# Altium schematic sheet LED_bargraph.SchDoc
size A3
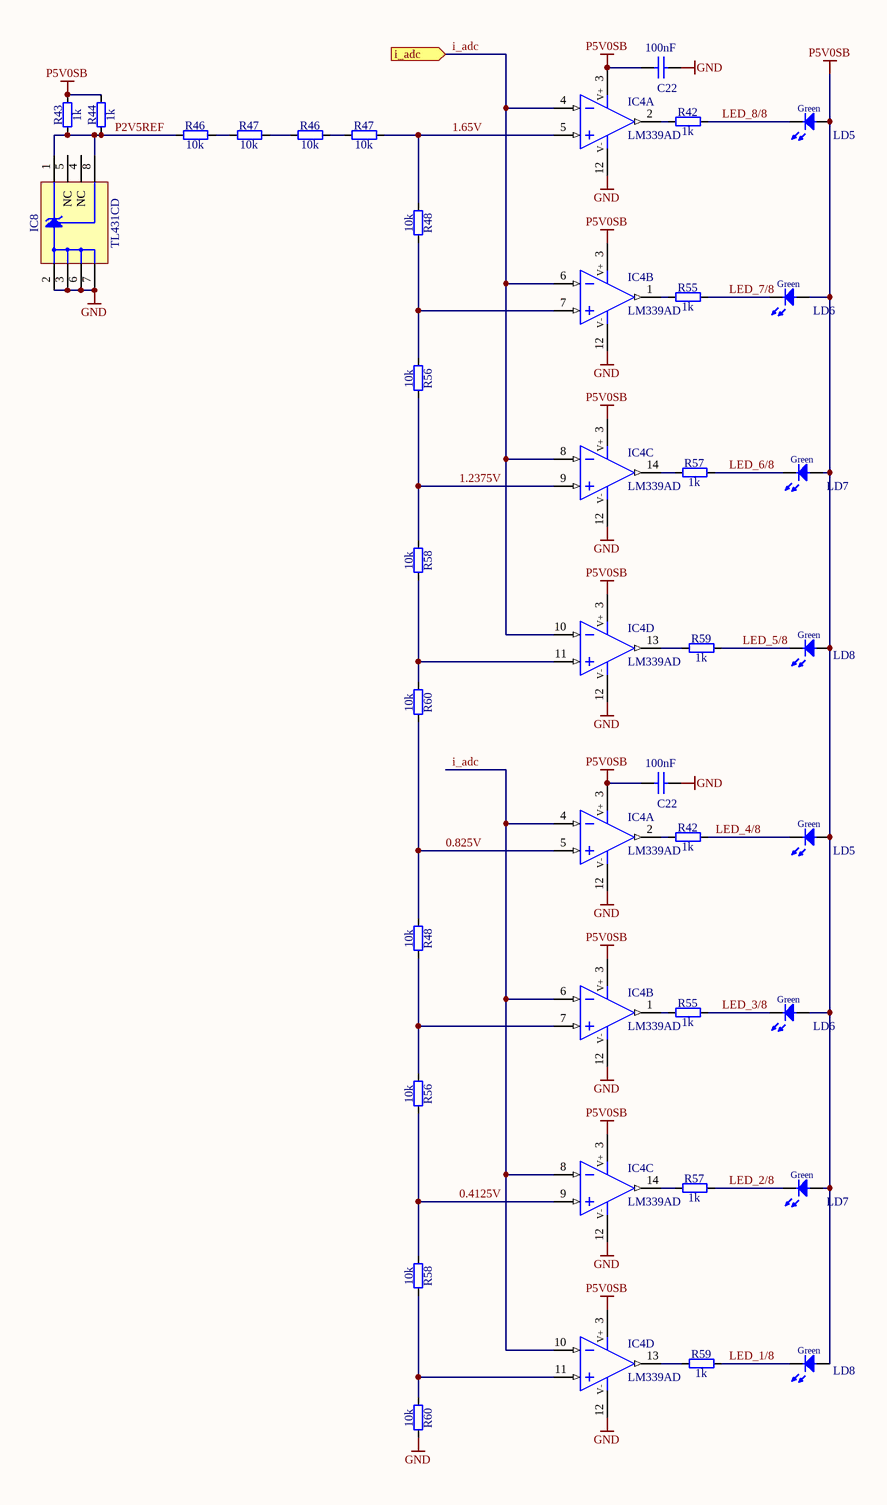
[diagram p0: LED_bargraph.SchDoc]

## Parts
(Parts that share a designator on the sheet are numbered #1, #2 ... from top to bottom, then left to right.)
C22#1  100nF  [CAPC1005X55N]
C22#2  100nF  [CAPC1005X55N]
IC4#1  LM339AD  [SOIC127P600X175-14N]  (parts A,B,C,D of 4)
IC4#2  LM339AD  [SOIC127P600X175-14N]  (parts A,B,C,D of 4)
IC8  TL431CD  [SOIC127P600X175-8N]
LD5#1  Green  [LED_AVAGO_HSME-C120]
LD5#2  Green  [LED_AVAGO_HSME-C120]
LD6#1  Green  [LED_AVAGO_HSME-C120]
LD6#2  Green  [LED_AVAGO_HSME-C120]
LD7#1  Green  [LED_AVAGO_HSME-C120]
LD7#2  Green  [LED_AVAGO_HSME-C120]
LD8#1  Green  [LED_AVAGO_HSME-C120]
LD8#2  Green  [LED_AVAGO_HSME-C120]
R42#1  1k  [RESC1608X55N]
R42#2  1k  [RESC1608X55N]
R43  1k  [RESC1608X55N]
R44  1k  [RESC1608X55N]
R46#1  10k  [RESC1608X55N]
R46#2  10k  [RESC1608X55N]
R47#1  10k  [RESC1608X55N]
R47#2  10k  [RESC1608X55N]
R48#1  10k  [RESC1608X55N]
R48#2  10k  [RESC1608X55N]
R55#1  1k  [RESC1608X55N]
R55#2  1k  [RESC1608X55N]
R56#1  10k  [RESC1608X55N]
R56#2  10k  [RESC1608X55N]
R57#1  1k  [RESC1608X55N]
R57#2  1k  [RESC1608X55N]
R58#1  10k  [RESC1608X55N]
R58#2  10k  [RESC1608X55N]
R59#1  1k  [RESC1608X55N]
R59#2  1k  [RESC1608X55N]
R60#1  10k  [RESC1608X55N]
R60#2  10k  [RESC1608X55N]

## Ports
i_adc (in)

## Nets
GND: C22#1.1 C22#2.1 IC4#1.12(V-) IC4#2.12(V-) IC8.2(A) IC8.3(A) IC8.6(A) IC8.7(A) R60#2.2
P5V0SB: C22#1.2 C22#2.2 IC4#1.3(V+) IC4#2.3(V+) LD5#1.2(A) LD5#2.2(A) LD6#1.2(A) LD6#2.2(A) LD7#1.2(A) LD7#2.2(A) LD8#1.2(A) LD8#2.2(A) R43.2 R44.2
0.825V: IC4#2.5(IN+) R48#2.1 R60#1.2
0.4125V: IC4#2.9(IN+) R56#2.2 R58#2.1
1.65V: IC4#1.5(IN+) R47#2.2 R48#1.1
1.2375V: IC4#1.9(IN+) R56#1.2 R58#1.1
i_adc: IC4#1.4(IN-) IC4#1.6(IN-) IC4#1.8(IN-) IC4#1.10(IN-) IC4#2.4(IN-) IC4#2.6(IN-) IC4#2.8(IN-) IC4#2.10(IN-) ; port i_adc
LED_1/8: LD8#2.1(C) R59#2.2
LED_2/8: LD7#2.1(C) R57#2.2
LED_3/8: LD6#2.1(C) R55#2.2
LED_4/8: LD5#2.1(C) R42#2.2
LED_5/8: LD8#1.1(C) R59#1.2
LED_6/8: LD7#1.1(C) R57#1.2
LED_7/8: LD6#1.1(C) R55#1.2
LED_8/8: LD5#1.1(C) R42#1.2
P2V5REF: IC8.1(C) IC8.8(REF) R43.1 R44.1 R46#1.1
NetIC4#1_1: IC4#1.1(OUT) R55#1.1
NetIC4#1_2: IC4#1.2(OUT) R42#1.1
NetIC4#1_7: IC4#1.7(IN+) R48#1.2 R56#1.1
NetIC4#1_11: IC4#1.11(IN+) R58#1.2 R60#1.1
NetIC4#1_13: IC4#1.13(OUT) R59#1.1
NetIC4#1_14: IC4#1.14(OUT) R57#1.1
NetIC4#2_1: IC4#2.1(OUT) R55#2.1
NetIC4#2_2: IC4#2.2(OUT) R42#2.1
NetIC4#2_7: IC4#2.7(IN+) R48#2.2 R56#2.1
NetIC4#2_11: IC4#2.11(IN+) R58#2.2 R60#2.1
NetIC4#2_13: IC4#2.13(OUT) R59#2.1
NetIC4#2_14: IC4#2.14(OUT) R57#2.1
NetR46#1_2: R46#1.2 R47#1.1
NetR46#2_1: R46#2.1 R47#1.2
NetR46#2_2: R46#2.2 R47#2.1

Not connected (* = marked no-connect by the designer): IC8 4(NC) 5(NC)

## Library data of the parts
C22#1 C22#2 = CC0402_100NF_25V_10%_X7R_YUDEN_TMK105B7104KVHF: Non-polarised capacitor; Part Description: SMD Multilayer Chip Ceramic Capacitor (High Dielectric Type) for Automotive / Industrial Applications; Manufacturer: TAIYO YUDEN; Voltage: 25V; TC: X7R; Tolerance: ±10%; Part Number: CC0402_100NF_25V_10%_X7R_YUDEN_TMK105B7104KVHF; Component Kind: Standard; Component Type: Standard; Pin Count: 2; Value: 100nF; Status: Not Recommended; Manufacturer Part Number: TMK105B7104KVHF; Case: 0402; Mounted: Yes; Socket: No; SMD: Yes; Sense: No; HelpURL: \\cern.ch\dfs\Applications\Altium\Datasheets\CC0402_TAIYO-YUDEN_TMK105B7104KVHF.pdf; Author: CERN DEM JLC; CreateDate: 10/05/2017; LatestRevisionDate: 10/05/2017; ComponentHeight: 0.55mm
IC4#1 IC4#2 = LM339AD: Quad Operational Amplifier; Part Description: Quad Differential Comparator; Manufacturer: TEXAS INSTRUMENTS; PressFit: No; Bonding: No; Part Number: LM339AD; Component Kind: Standard; Component Type: Standard; Device: LM339AD; PackageDescription: SOIC 14, Pitch 1.27mm - Body 4x8.75mm, IPC Medium Density; Manufacturer Part Number: LM339AD; Pin Count: 14; Case: SOIC14; Mounted: Yes; Socket: No; SMD: Yes; Sense: No; ComponentHeight: 1.75mm; Author: CERN DEM JLC; HelpURL: \\cern.ch\dfs\Applications\Altium\Datasheets\LM339AD.pdf; CreateDate: 09.03.2011; LatestRevisionDate: 09.03.2011
IC8 = TL431CD: Precision Programmable Reference; Part Description: Vref (2.5V) To 36V 2% Precision Programmable Reference; Manufacturer: TEXAS INSTRUMENTS; PressFit: No; Bonding: No; Part Number: TL431CD; Component Kind: Standard; Component Type: Standard; Device: TL431CD; PackageDescription: SOIC 8, Pitch 1.27mm, Body 4x5mm, IPC Medium Density; Manufacturer Part Number: TL431CD; Pin Count: 8; Case: SOIC8; Mounted: Yes; Socket: No; SMD: Yes; Sense: No; ComponentHeight: 1.75mm; HelpURL: \\cern.ch\dfs\Applications\Altium\Datasheets\TL431CD.pdf; Author: CERN DEM JLC; CreateDate: 18.01.2011; LatestRevisionDate: 28.02.2011
LD5#1 LD5#2 LD6#1 LD6#2 LD7#1 LD7#2 LD8#1 LD8#2 = LED_AVAGO_HSME-C120: LED Green 1C 2A; Part Description: High Performance Right Angle Chip Green LED; Manufacturer: AVAGO TECHNOLOGIES; PressFit: No; Bonding: No; Part Number: LED_AVAGO_HSME-C120; Component Kind: Standard; Component Type: Standard; Color: Green; PackageDescription: Green Chip LED, 2-Leads, Body 1.7x1.1mm, Side Emitting Package; Manufacturer Part Number: HSME-C120; Pin Count: 2; Mounted: Yes; Socket: No; SMD: Yes; Sense: No; ComponentHeight: 0.7mm; HelpURL: \\cern.ch\dfs\Applications\Altium\Datasheets\LED_AVAGO_HSME-C120.pdf; ComponentLink1URL: \\cern.ch\dfs\Applications\Altium\Datasheets\LED_AVAGO_HSME-C110_DESIGN-GUIDE.pdf; ComponentLink1Description: Design Guide; Author: CERN DEM JMW; CreateDate: 22.07.2009; LatestRevisionDate: 20.06.2012
R42#1 R42#2 R43 R44 R55#1 R55#2 R57#1 R57#2 R59#1 R59#2 = R0603_1K_1%_0.1W_100PPM: Resistor - 1%; Part Description: General Purpose Thick Film Chip Resistor; Manufacturer: GENERIC; Manufacturer1 Part Number: NRC06F1001TRF; Power: 0.1W; TC: ±100ppm/°C; PressFit: No; Part Number: R0603_1K_1%_0.1W_100PPM; Component Kind: Standard; Component Type: Standard; Pin Count: 2; Value: 1k; Status: Preferred; Tolerance: ±1%; Manufacturer Part Number: R0603_1K_1%_0.1W_100PPM; Case: 0603; Mounted: Yes; Sense: No; Socket: No; SMD: Yes; Manufacturer1 Example: NIC COMPONENT; Manufacturer1 ComponentHeight: 0.55mm; HelpURL: \\cern.ch\dfs\Applications\Altium\Datasheets\R0603_NIC_NRC.pdf; Author: CERN DEM JLC; CreateDate: 03.12.2007; LatestRevisionDate: 13.03.2008
R46#1 R46#2 R47#1 R47#2 R48#1 R48#2 R56#1 R56#2 R58#1 R58#2 R60#1 R60#2 = R0603_10K_1%_0.1W_100PPM: Resistor - 1%; Part Description: General Purpose Thick Film Chip Resistor; Manufacturer: GENERIC; Manufacturer1 Part Number: NRC06F1002TRF; Power: 0.1W; TC: ±100ppm/°C; PressFit: No; Part Number: R0603_10K_1%_0.1W_100PPM; Component Kind: Standard; Component Type: Standard; Pin Count: 2; Value: 10k; Status: Preferred; Tolerance: ±1%; Manufacturer Part Number: R0603_10K_1%_0.1W_100PPM; Case: 0603; Mounted: Yes; Sense: No; Socket: No; SMD: Yes; Manufacturer1 Example: NIC COMPONENT; Manufacturer1 ComponentHeight: 0.55mm; HelpURL: \\cern.ch\dfs\Applications\Altium\Datasheets\R0603_NIC_NRC.pdf; Author: CERN DEM JLC; CreateDate: 03.12.2007; LatestRevisionDate: 13.03.2008